# EAGLE design skware-one-rev-arm-25-mini (EAGLE 9.1.0)
CNAME: Omzlo; DESIGNER: Alain Pannetrat
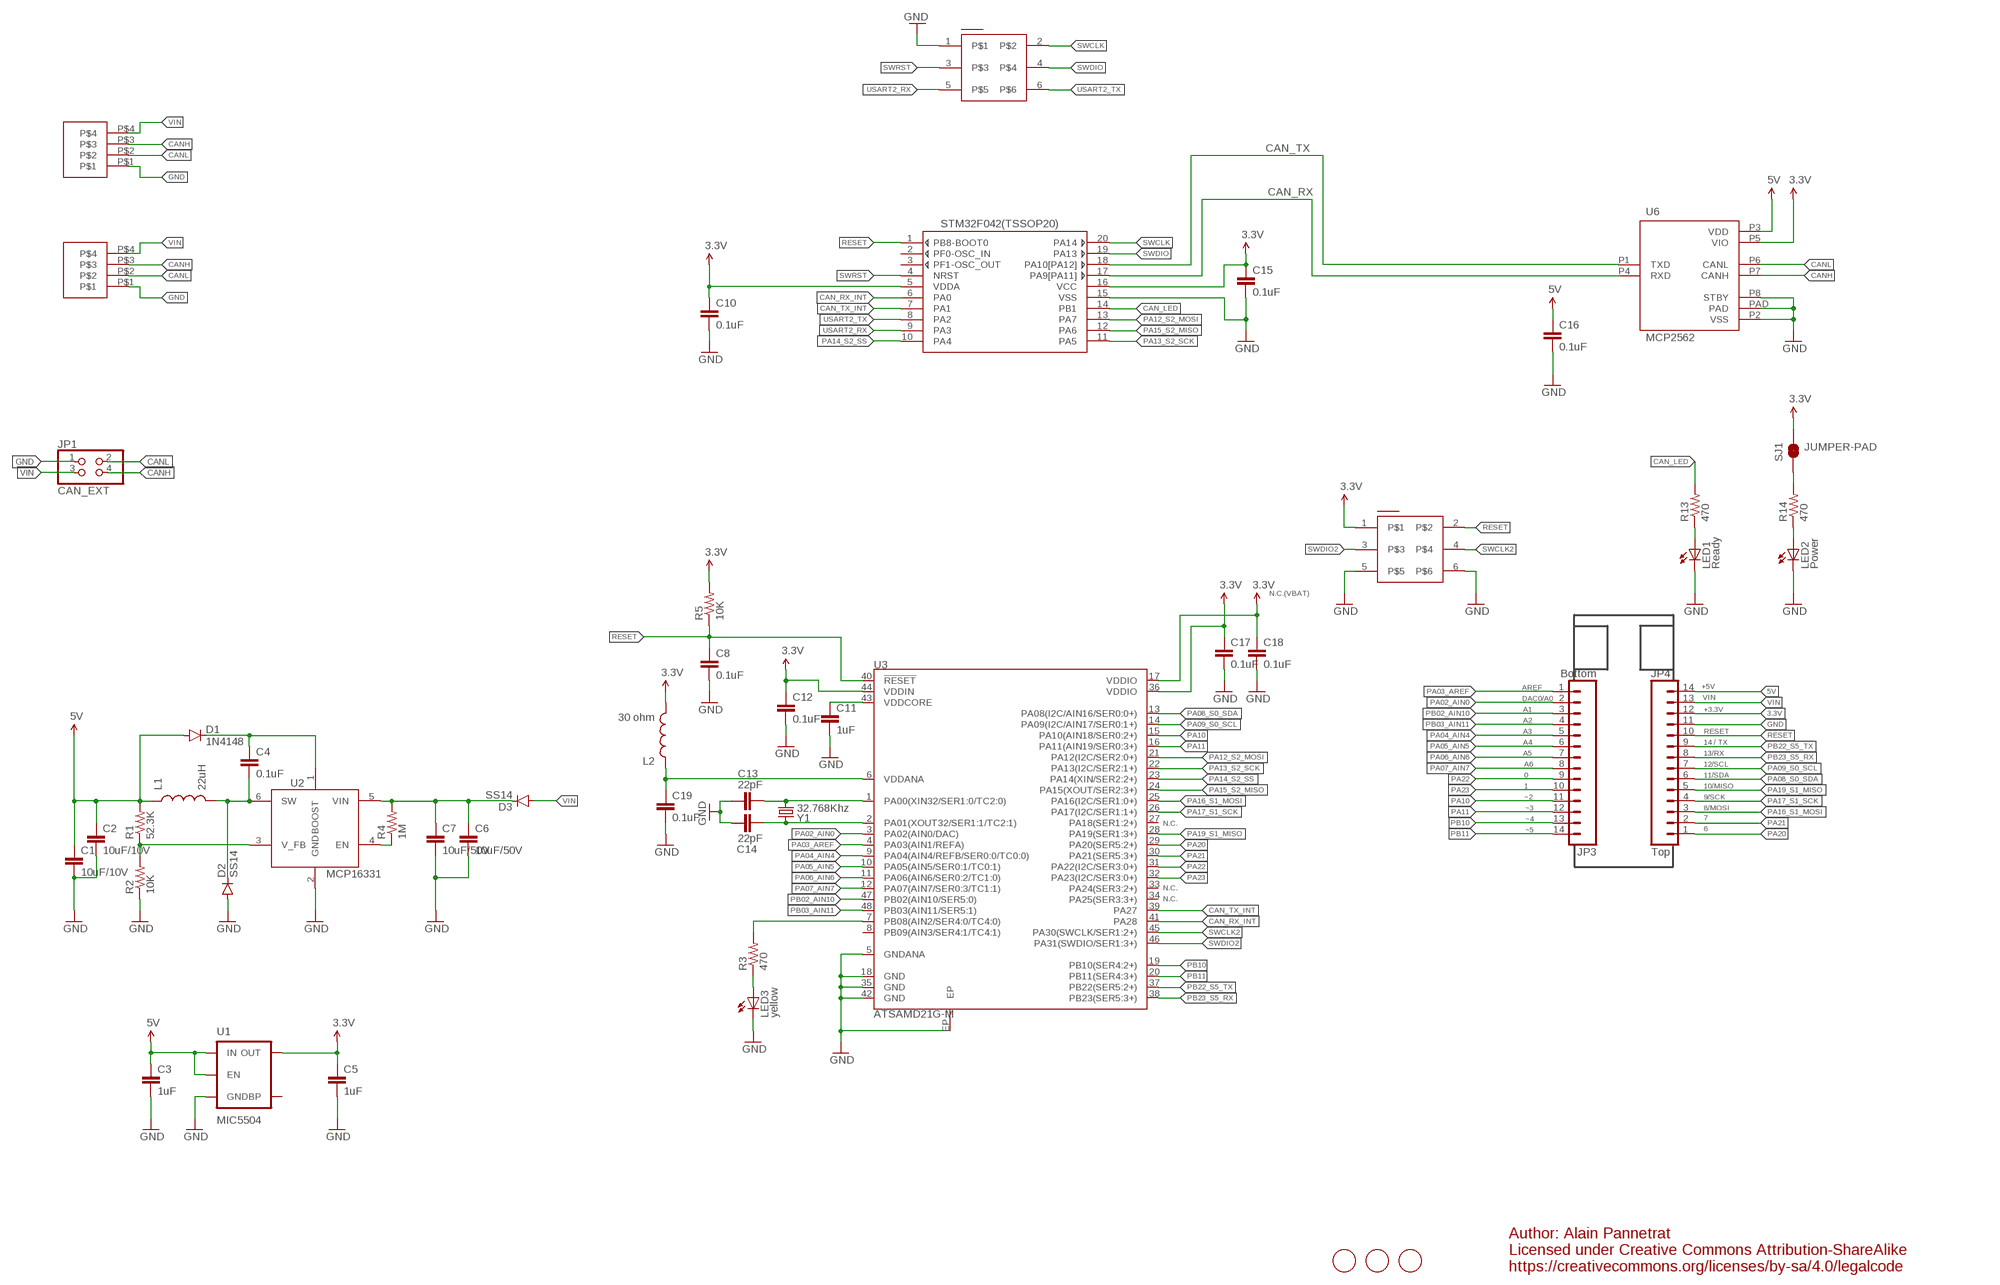
[diagram p0: schematic, sheet 1]

## Parts
C1  10uF/10V  CAP0805  [0805]
C2  10uF/10V  CAP0805  [0805]
C3  1uF  CAP0805  [0805]
C4  0.1uF  CAP0603-CAP  [0603-CAP]
C5  1uF  CAP0805  [0805]
C6  10uF/50V  CAP1206  [1206]
C7  10uF/50V  CAP1206  [1206]
C8  0.1uF  CAP0603-CAP  [0603-CAP]
C10  0.1uF  CAP0603-CAP  [0603-CAP]
C11  1uF  CAP0805  [0805]
C12  0.1uF  CAP0603-CAP  [0603-CAP]
C13  22pF  CAP0805  [0805]
C14  22pF  CAP0805  [0805]
C15  0.1uF  CAP0603-CAP  [0603-CAP]
C16  0.1uF  CAP0603-CAP  [0603-CAP]
C17  0.1uF  CAP0603-CAP  [0603-CAP]
C18  0.1uF  CAP0603-CAP  [0603-CAP]
C19  0.1uF  CAP0603-CAP  [0603-CAP]
D1  1N4148  DIODEBAS16  [SOD-323]
D2  SS14  DIODESMA-ALT  [SMA-DIODE_ALT]
D3  SS14  DIODESMA-ALT  [SMA-DIODE_ALT]
JP1  CAN_EXT  PINHD-2X2  [2X02]
JP3  Bottom  M14  [1X14]
JP4  Top  M14  [1X14]
L1  22uH  INDUCTORBOURNS_SRN6045  [SRN6045]
L2  30 ohm  INDUCTOR30OHM,1.8A  [0603]
LED1  Ready  LEDSML0805  [SML0805]
LED2  Power  LEDSML0805  [SML0805]
LED3  yellow  LEDSML0805  [SML0805]
R1  52.3K  RESISTOR0805-RES  [0805]
R2  10K  RESISTOR0805-RES  [0805]
R3  470  RESISTOR0603-RES  [0603-RES]
R4  1M  RESISTOR0805-RES  [0805]
R5  10K  RESISTOR0805-RES  [0805]
R13  470  RESISTOR0603-RES  [0603-RES]
R14  470  RESISTOR0603-RES  [0603-RES]
SJ1  JUMPER-PAD  JUMPER-PAD-2-NC_BY_TRACE  [PAD-JUMPER-2-NC_BY_TRACE_YES_SILK]
U1  MIC5504  V_REG_LDOSMD  [SOT23-5]
U2  MCP16331  [SOT23-6]
U3  ATSAMD21G-M  [QFN-48]
U4  STM32F042(TSSOP20)  [TSSOP20]
U6  MCP2562  [DFN3X3]
U$1  M04-PLUG-3.5  [M04-PLUG-3.5]
U$3  M04-PLUG-3.5  [M04-PLUG-3.5]
U$4  3X2-SMT-PROG  [2X3-SMT-HEAD]
U$5  3X2-SMT-PROG  [2X3-SMT-HEAD]
U$6  FIDUCIAL  [FIDUCIAL_1MM]
U$7  FIDUCIAL  [FIDUCIAL_1MM]
U$8  FIDUCIAL  [FIDUCIAL_1MM]
Y1  32.768Khz  CRYSTAL3.2X1.5MM  [CRYSTAL-SMD-3.2X1.5MM]

## Nets
3.3V: C5.1 C10.1 C12.1 C15.1 C17.1 C18.1 JP4.12 L2.2 R5.2 SJ1.2 U1.5(OUT) U3.17(VDDIO) U3.36(VDDIO) U3.44(VDDIN) U4.5(VDDA) U4.16(VCC) U6.P5(VIO) U$4.1
5V: C1.1 C2.1 C3.1 C16.1 D1.A JP4.14 L1.1 R1.2 U1.1(IN) U1.3(EN) U6.P3(VDD)
A1: R3.2 U3.7(PB08(AIN2/SER4:0/TC4:0))
CAN_LED: R13.2 U4.14(PB1)
CAN_RX: U4.17(PA9[PA11]) U6.P4(RXD)
CAN_RX_INT: U3.41(PA28) U4.6(PA0)
CAN_TX: U4.18(PA10[PA12]) U6.P1(TXD)
CAN_TX_INT: U3.39(PA27) U4.7(PA1)
CANH: JP1.4 U6.P7(CANH) U$1.P$3 U$3.P$3
CANL: JP1.2 U6.P6(CANL) U$1.P$2 U$3.P$2
GND: C1.2 C2.2 C3.2 C5.2 C6.2 C7.2 C8.2 C10.2 C11.2 C12.2 C13.1 C14.1 C15.2 C16.2 C17.2 C18.2 C19.2 D2.A JP1.1 JP4.11 LED1.C LED2.C LED3.C R2.1 U1.2(GND) U2.2(GND) U3.5(GNDANA) U3.18(GND) U3.35(GND) U3.42(GND) U3.EP U4.15(VSS) U6.P2(VSS) U6.P8(STBY) U6.PAD U$1.P$1 U$3.P$1 U$4.5 U$4.6 U$5.1
N$1: R4.1 U2.4(EN)
N$2: C11.1 U3.43(VDDCORE)
N$3: C13.2 U3.1(PA00(XIN32/SER1:0/TC2:0)) Y1.P$2
N$4: C14.2 U3.2(PA01(XOUT32/SER1:1/TC2:1)) Y1.P$1
N$5: C19.1 L2.1 U3.6(VDDANA)
N$6: R14.2 SJ1.1
N$7: LED2.A R14.1
N$8: C6.1 C7.1 D3.C R4.2 U2.5(VIN)
N$9: LED3.A R3.1
N$13: LED1.A R13.1
N$16: R1.1 R2.2 U2.3(V_FB)
N$17: C4.2 D2.C L1.2 U2.6(SW)
N$18: C4.1 D1.C U2.1(BOOST)
PA02_AIN0: JP3.2 U3.3(PA02(AIN0/DAC))
PA03_AREF: JP3.1 U3.4(PA03(AIN1/REFA))
PA04_AIN4: JP3.5 U3.9(PA04(AIN4/REFB/SER0:0/TC0:0))
PA05_AIN5: JP3.6 U3.10(PA05(AIN5/SER0:1/TC0:1))
PA06_AIN6: JP3.7 U3.11(PA06(AIN6/SER0:2/TC1:0))
PA07_AIN7: JP3.8 U3.12(PA07(AIN7/SER0:3/TC1:1))
PA08_S0_SDA: JP4.6 U3.13(PA08(I2C/AIN16/SER0:0+))
PA09_S0_SCL: JP4.7 U3.14(PA09(I2C/AIN17/SER0:1+))
PA10: JP3.11 U3.15(PA10(AIN18/SER0:2+))
PA11: JP3.12 U3.16(PA11(AIN19/SER0:3+))
PA12_S2_MOSI: U3.21(PA12(I2C/SER2:0+)) U4.13(PA7)
PA13_S2_SCK: U3.22(PA13(I2C/SER2:1+)) U4.11(PA5)
PA14_S2_SS: U3.23(PA14(XIN/SER2:2+)) U4.10(PA4)
PA15_S2_MISO: U3.24(PA15(XOUT/SER2:3+)) U4.12(PA6)
PA16_S1_MOSI: JP4.3 U3.25(PA16(I2C/SER1:0+))
PA17_S1_SCK: JP4.4 U3.26(PA17(I2C/SER1:1+))
PA19_S1_MISO: JP4.5 U3.28(PA19(SER1:3+))
PA20: JP4.1 U3.29(PA20(SER5:2+))
PA21: JP4.2 U3.30(PA21(SER5:3+))
PA22: JP3.9 U3.31(PA22(I2C/SER3:0+))
PA23: JP3.10 U3.32(PA23(I2C/SER3:0+))
PB02_AIN10: JP3.3 U3.47(PB02(AIN10/SER5:0))
PB03_AIN11: JP3.4 U3.48(PB03(AIN11/SER5:1))
PB10: JP3.13 U3.19(PB10(SER4:2+))
PB11: JP3.14 U3.20(PB11(SER4:3+))
PB22_S5_TX: JP4.9 U3.37(PB22(SER5:2+))
PB23_S5_RX: JP4.8 U3.38(PB23(SER5:3+))
RESET: C8.1 JP4.10 R5.1 U3.40(!RESET!) U4.1(PB8-BOOT0) U$4.2
SWCLK: U4.20(PA14) U$5.2
SWCLK2: U3.45(PA30(SWCLK/SER1:2+)) U$4.4
SWDIO: U4.19(PA13) U$5.4
SWDIO2: U3.46(PA31(SWDIO/SER1:3+)) U$4.3
SWRST: U4.4(NRST) U$5.3
USART2_RX: U4.9(PA3) U$5.5
USART2_TX: U4.8(PA2) U$5.6
VIN: D3.A JP1.3 JP4.13 U$1.P$4 U$3.P$4
Unconnected: U1.4(BP) U3.8(PB09(AIN3/SER4:1/TC4:1)) U3.27(PA18(SER1:2+)) U3.33(PA24(SER3:2+)) U3.34(PA25(SER3:3+)) U4.2(PF0-OSC_IN) U4.3(PF1-OSC_OUT)

## Notes on the sheet
- N.C.(VBAT)
- AREF | +5V
- DAC0/A0 | VIN
- A1 | +3.3V
- A2
- A3 | RESET
- A4 | 14 / TX
- A5 | 13/RX
- A6 | 12/SCL
- 0 | 11/SDA
- 1 | 10/MISO
- ~2 | 9/SCK
- ~3 | 8/MOSI
- ~4 | 7
- N.C.
- ~5 | 6
- N.C.
- N.C.
- Author: Alain Pannetrat
  Licensed under Creative Commons Attribution-ShareAlike
  https://creativecommons.org/licenses/by-sa/4.0/legalcode

## Library data of the parts
C1-C3 C5-C7 = SparkFun-Capacitors:CAP: Capacitor Standard 0603 ceramic capacitor, and 0.1" leaded capacitor.
C4 C8 C10-C19 = SparkFun-Passives:CAP: Capacitor Standard 0603 ceramic capacitor, and 0.1" leaded capacitor.
D1 = SparkFun-DiscreteSemi:DIODE: Diode These are standard reverse protection diodes and small signal diodes. SMA package can handle up to about 1A. SOD-323 can handle about 200mA. What the SOD-323 package when ordering, there are some mfgs out there that are 5-pin packages.; PROD_ID: DIO-09646; VALUE: 250mA/100V
D2 D3 = SparkFun-DiscreteSemi:DIODE: Diode These are standard reverse protection diodes and small signal diodes. SMA package can handle up to about 1A. SOD-323 can handle about 200mA. What the SOD-323 package when ordering, there are some mfgs out there that are 5-pin packages.
JP1 = pinhead:PINHD-2X2: PIN HEADER
JP3 JP4 = SparkFun-Connectors:M14: Header 14 Standard 14-pin 0.1" header. Use with straight break away headers (SKU : PRT-00116), right angle break away headers (PRT-00553), swiss pins (PRT-00743), machine pins (PRT-00117), and female headers (PRT-00115).
L1 = SparkFun-Passives:INDUCTOR: Inductors Basic Inductor/Choke - 0603 and 1206. Footprints are not proven and vary greatly between part numbers. INDUCTOR POWER 3.3UH 4.0A SMD 0.197" L x 0.197" W x 0.177" H (5.00mm x 5.00mm x 4.50mm); PROD_ID: NDUC-11627; VALUE: 33uH
L2 = SparkFun-Passives:INDUCTOR: Inductors Basic Inductor/Choke - 0603 and 1206. Footprints are not proven and vary greatly between part numbers. INDUCTOR POWER 3.3UH 4.0A SMD 0.197" L x 0.197" W x 0.177" H (5.00mm x 5.00mm x 4.50mm); PROD_ID: RES-07859
LED1-LED3 = led:LED: LED OSRAM: - CHIPLED LG R971, LG N971, LY N971, LG Q971, LY Q971, LO R971, LY R971 LH N974, LH R974 LS Q976, LO Q976, LY Q976 LO Q996 - Hyper CHIPLED LW Q18S LB Q993, LB Q99A, LB R99A - SideLED LS A670, LO A670, LY A670, LG A670, LP A670 LB A673, LV A673, LT A673, LW A673 LH A674 LY A675 LS A676, LA A676, LO A676, LY A676, LW A676 LS A679, LY A679, LG A679 - Hyper Micro SIDELED® LS Y876, LA Y876, LO Y876, LY Y876 LT Y87S - SmartLED LW L88C, LW L88S LB L89C, LB L89S, LG L890 LS L89K, LO L89K, LY L89K LS L896, LA L896, LO L896, LY L896 - TOPLED LS T670, LO T670, LY T670, LG T670, LP T670 LSG T670, LSP T670, LSY T670, LOP T670, LYG T670 LG T671, LOG T671, LSG T671 LB T673, LV T673, LT T673, LW T673 LH T674 LS T676, LA T676, LO T676, LY T676, LB T676, LH T676, LSB T676, LW T676 LB T67C, LV T67C, LT T67C, LS T67K, LO T67K, LY T67K, LW E67C LS E67B, LA E67B, LO E67B, LY E67B, LB E67C, LV E67C, LT E67C LW T67C LS T679, LY T679, LG T679 LS T770, LO T770, LY T770, LG T770, LP T770 LB T773, LV T773, LT T773, LW T773 LH T774 LS E675, LA E675, LY E675, LS T675 LS T776, LA T776, LO T776, LY T776, LB T776 LHGB T686 LT T68C, LB T68C - Hyper Mini TOPLED® LB M676 - Mini TOPLED Santana® LG M470 LS M47K, LO M47K, LY M47K Source: http://www.osram.convergy.de LUXEON: - LUMILED® LXK2-PW12-R00, LXK2-PW12-S00, LXK2-PW14-U00, LXK2-PW14-V00 LXK2-PM12-R00, LXK2-PM12-S00, LXK2-PM14-U00 LXK2-PE12-Q00, LXK2-PE12-R00, LXK2-PE12-S00, LXK2-PE14-T00, LXK2-PE14-U00 LXK2-PB12-K00, LXK2-PB12-L00, LXK2-PB12-M00, LXK2-PB14-N00, LXK2-PB14-P00, LXK2-PB14-Q00 LXK2-PR12-L00, LXK2-PR12-M00, LXK2-PR14-Q00, LXK2-PR14-R00 LXK2-PD12-Q00, LXK2-PD12-R00, LXK2-PD12-S00 LXK2-PH12-R00, LXK2-PH12-S00 LXK2-PL12-P00, LXK2-PL12-Q00, LXK2-PL12-R00 Source: www.luxeon.com KINGBRIGHT: KA-3528ASYC Source: www.kingbright.com
R1-R5 R13 R14 = SparkFun-Resistors:RESISTOR: Resistor Basic schematic elements and footprints for 0603, 1206, and PTH resistors.
SJ1 = SparkFun-Passives:JUMPER-PAD-2-NC_BY_TRACE
U1 = SparkFun-PowerIC:V_REG_LDO: Voltage Regulator LDO Standard 150mA LDO voltage regulator in SOT-23 layout. Micrel part MIC5205. BP (by-pass) pin is used to lower output noise with 470pF cap.
U2 = AlainElements:MCP16331: High-Voltage Input Integrated Switch Step-Down Regulator, 500 mA The MCP16331 is a highly integrated, high-efficiency, fixed frequency, step-down DC-DC converter in a popular 6-pin SOT-23 or 8-pin TDFN 2x3 package that operates from input voltage sources up to 50V. http://www.mouser.com/ds/2/268/20005308B-708938.pdf
U3 = SparkFun-DigitalIC:ATSAMD21G: Atmel SAMD21G SMART ARM-Based Microcontroller The Atmel ® | SMART ™ SAM D21 is a series of low-power microcontrollers using the 32-bit ARM ® Cortex ® -M0+ processor, and ranging from 32- to 64-pins with up to 256KB Flash and 32KB of SRAM. The SAM D21 devices operate at a maximum frequency of 48MHz and reach 2.46 CoreMark/MHz. They are designed for simple and intuitive migration with identical peripheral modules, hex compatible code, identical linear address map and pin compatible migration paths between all devices in the product series. All devices include intelligent and flexible peripherals, Atmel Event System for inter-peripheral signaling, and support for capacitive touch button, slider and wheel user interfaces.; PROD_ID: IC-13064
U4 = AlainElements:STM32F042(TSSOP20)
U6 = can:MCP2562
U$1 U$3 = AlainConnector:M04-PLUG-3.5
U$4 U$5 = AlainConnector:3X2-SMT-PROG
U$6-U$8 = adafruit:FIDUCIAL: For use by pick and place machines to calibrate the vision/machine, 1mm By microbuilder.eu
Y1 = SparkFun-FreqCtrl:CRYSTAL: Various standard crystals. Proven footprints.

## Board
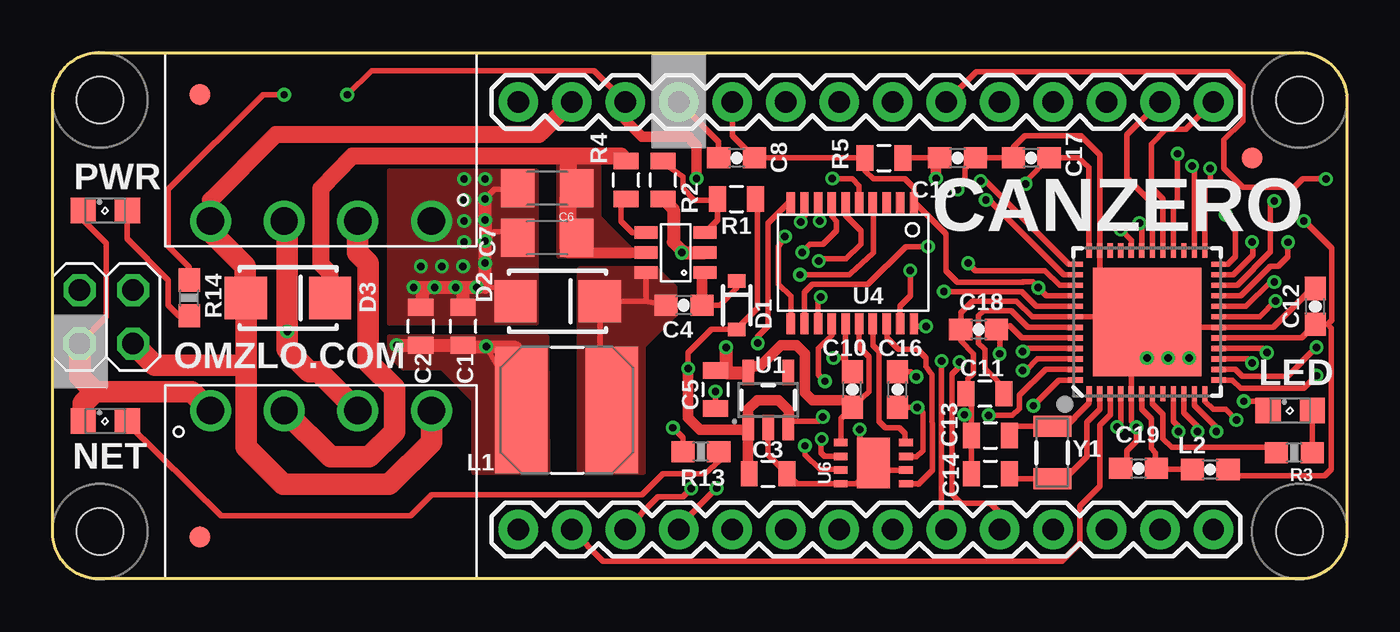
[diagram p1: board, top side]
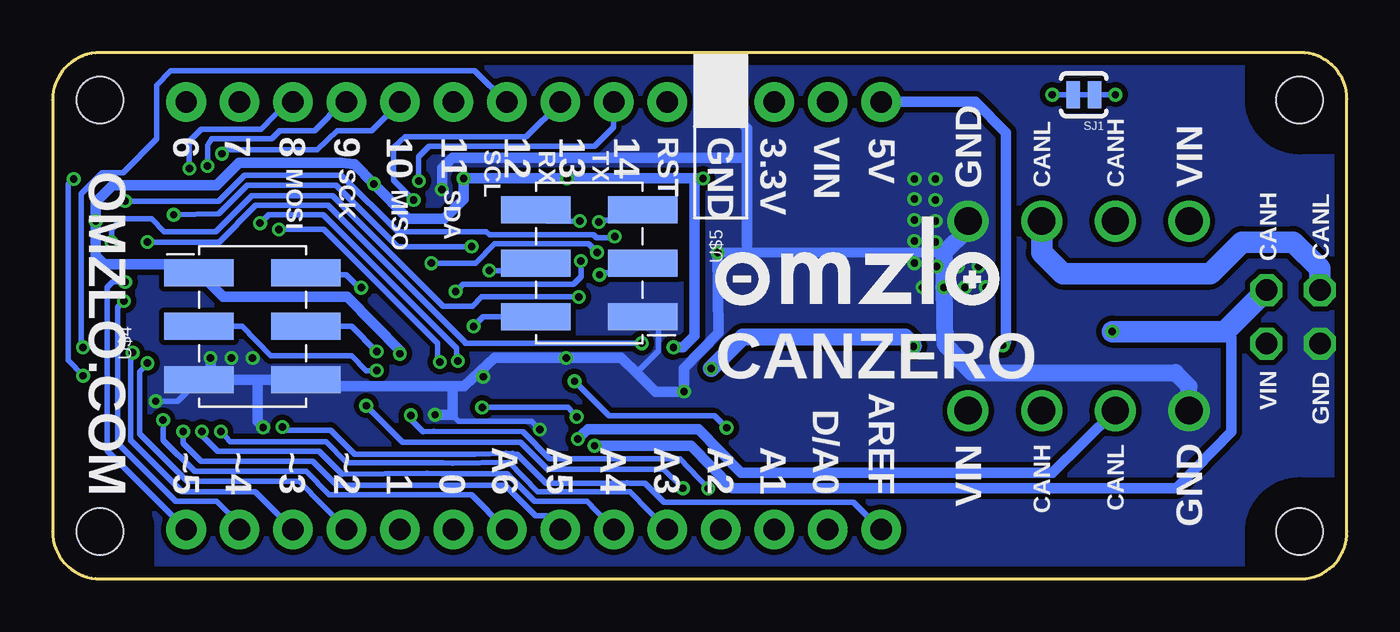
[diagram p2: board, bottom side, seen from below]

Size 61.5 x 25 mm. Coordinates in mm from the lower left corner, seen from the top.
Outline: 2.2,25 59.25,25 arc-90 61.5,22.75 61.5,2.25 arc-90 59.25,0 2.15,0 arc-90 0,2.25 0,22.8 arc-90 2.2,25
Copper layers (1*16): Top 0.035mm / dielectric 1.6mm / Bottom 0.035mm
Design rules "Elecrow_2-layer_PCB_eagle_rule *": minimum track width 6mil, minimum drill 12mil, track to track 6mil, track to pad 6mil, pad to pad 6mil, via to via 8mil, smd to smd 0mil, copper to edge 20mil, drill to drill 10mil, minimum pad ring 6mil, minimum via ring 6mil, stop-mask expansion 0mil, vias tented up to drill 100mil, thermal gap 10mil
Holes 2.2 mm at 2.25,2.25 2.25,22.75 59.25,22.75 59.25,2.25
tRestrict: area 0,20.5 to 4.5,25; area 0,0 to 4.5,4.5; area 57,20.5 to 61.5,25; area 57,0 to 61.5,4.5
bRestrict: area 0,20.5 to 4.5,25; area 0,0 to 4.5,4.5; area 57,20.5 to 61.5,25; area 57,0 to 61.5,4.5

### Footprints (pad centres in the part's own frame; a part is rotated, then mirrored left to right if it is on the bottom)
0805 = smd 0.8 x 1.2: 1 -0.9,0; 2 0.9,0
0603-CAP = smd 1.1 x 1: 1 -0.85,0; 2 0.85,0
1206 = smd 1.6 x 1.8: 1 -1.4,0; 2 1.4,0
SOD-323 = smd 0.63 x 0.83: A 1.15,0; C -1.15,0
SMA-DIODE_ALT = smd 2 x 2: A -2,0; C 2,0
2X02 = drill 1.016 octagon: 1 -1.27,-1.27; 2 -1.27,1.27; 3 1.27,-1.27; 4 1.27,1.27
1X14 = drill 1.016 pad 1.88: 1 0,0; 2 2.54,0; 3 5.08,0; 4 7.62,0; 5 10.16,0; 6 12.7,0; 7 15.24,0; 8 17.78,0; 9 20.32,0; 10 22.86,0; 11 25.4,0; 12 27.94,0; 13 30.48,0; 14 33.02,0
SRN6045 = smd 2.5 x 6: 1 -2.175,-0.175; 2 2.125,-0.175
0603 = smd 1.1 x 1: 1 -0.85,0; 2 0.85,0
SML0805 = smd 1.2 x 1.2: A 1.05,0; C -1.05,0
0603-RES = smd 1.1 x 1: 1 -0.85,0; 2 0.85,0
PAD-JUMPER-2-NC_BY_TRACE_YES_SILK = smd 0.635 x 1.27: 1 -0.508,0; 2 0.508,0
SOT23-5 = smd 0.55 x 1.2: 1 -0.95,-1.3; 2 0,-1.3; 3 0.95,-1.3; 4 0.95,1.3; 5 -0.95,1.3
SOT23-6 = smd 0.6 x 1.1: 1 -0.95,-1.4; 2 0,-1.4; 3 0.95,-1.4; 4 0.95,1.4; 5 0,1.4; 6 -0.95,1.4
QFN-48 = smd 0.7 x 0.25: 1 -3.4,2.75; 2 -3.4,2.25; 3 -3.4,1.75; 4 -3.4,1.25; 5 -3.4,0.75; 6 -3.4,0.25; 7 -3.4,-0.25; 8 -3.4,-0.75; 9 -3.4,-1.25; 10 -3.4,-1.75; 11 -3.4,-2.25; 12 -3.4,-2.75; 25 3.4,-2.75; 26 3.4,-2.25; 27 3.4,-1.75; 28 3.4,-1.25; 29 3.4,-0.75; 30 3.4,-0.25; 31 3.4,0.25; 32 3.4,0.75; 33 3.4,1.25; 34 3.4,1.75; 35 3.4,2.25; 36 3.4,2.75 | smd 0.25 x 0.7: 13 -2.75,-3.4; 14 -2.25,-3.4; 15 -1.75,-3.4; 16 -1.25,-3.4; 17 -0.75,-3.4; 18 -0.25,-3.4; 19 0.25,-3.4; 20 0.75,-3.4; 21 1.25,-3.4; 22 1.75,-3.4; 23 2.25,-3.4; 24 2.75,-3.4; 37 2.75,3.4; 38 2.25,3.4; 39 1.75,3.4; 40 1.25,3.4; 41 0.75,3.4; 42 0.25,3.4; 43 -0.25,3.4; 44 -0.75,3.4; 45 -1.25,3.4; 46 -1.75,3.4; 47 -2.25,3.4; 48 -2.75,3.4 | smd 5.15 x 5.15: EP 0,0
TSSOP20 = smd 1 x 0.4: 1 -2.875,2.925; 2 -2.875,2.275; 3 -2.875,1.625; 4 -2.875,0.975; 5 -2.875,0.325; 6 -2.875,-0.325; 7 -2.875,-0.975; 8 -2.875,-1.625; 9 -2.875,-2.275; 10 -2.875,-2.925; 11 2.875,-2.925; 12 2.875,-2.275; 13 2.875,-1.625; 14 2.875,-0.975; 15 2.875,-0.325; 16 2.875,0.325; 17 2.875,0.975; 18 2.875,1.625; 19 2.875,2.275; 20 2.875,2.925
DFN3X3 = smd 0.35 x 0.65: P1 -0.975,-1.55; P2 -0.325,-1.55; P3 0.325,-1.55; P4 0.975,-1.55; P5 0.975,1.55; P6 0.325,1.55; P7 -0.325,1.55; P8 -0.975,1.55 | smd 2.4 x 1.55: PAD 0,0
M04-PLUG-3.5 = drill 1.3: P$1 0,0; P$2 3.5,0; P$3 7,0; P$4 10.5,0
2X3-SMT-HEAD = smd 1.27 x 3.302: 1 -2.54,-2.54; 2 -2.54,2.54; 3 0,-2.54; 4 0,2.54; 5 2.54,-2.54; 6 2.54,2.54
FIDUCIAL_1MM = smd 1 x 1: 1 0,0
CRYSTAL-SMD-3.2X1.5MM = smd 1 x 1.8: P$1 -1.25,0; P$2 1.25,0

### Placement (x,y rotation side)
C1  19.5,12 90 top
C2  17.5,12 90 top
C3  34,5 0 top
C4  30,13 180 top
C5  31.5,9 270 top
C6  23.5,18.55 180 top
C7  23.5,16.2 180 top
C8  32.5,20 180 top
C10  38,9 90 top
C11  44.3,8.8 180 top
C12  60,12.95 90 top
C13  44.56,6.82 0 top
C14  44.56,5 0 top
C15  43,20 0 top
C16  40.15,9 90 top
C17  46.5,20 180 top
C18  44,11.85 180 top
C19  51.6,5.25 180 top
D1  32.5,13 270 top
D2  24,13.2 0 top
D3  11.18,13.35 0 top
JP1  2.55,12.45 0 top
JP3  22.13,2.34 0 top
JP4  55.15,22.66 180 top
L1  24.45,8.2 0 top
L2  55,5.2 0 top
LED1  2.5,7.5 0 top
LED2  2.5,17.5 0 top
LED3  58.8,8 0 top
R1  32.5,18.05 0 top
R2  29,18.95 90 top
R3  59,6 180 top
R4  27.25,18.95 90 top
R5  39.5,20 0 top
R13  30.8,6.05 180 top
R14  6.5,13.35 90 top
SJ1  12.5,23 180 bottom
U1  34,8.5 0 top
U2  29.6,15.5 90 top
U3  52,12.2 90 top
U4  38,15 270 top
U6  39,5.5 90 top
U$1  7.5,8 0 top
U$2  [OMZLO-0.5]  30,13 0 bottom
U$3  18,17 180 top
U$4  52,12 270 bottom
U$5  36,15 90 bottom
U$6  7,2 0 top
U$7  7,23 0 top
U$8  57,20 0 top
Y1  47.5,6 90 top

### Tracks (layer width: path | path; a pad name or v marks a point on that pad's centre or on a via)
3.3V  (via drill 0.35)
  Top 0.254: JP4.12 25.73,24.15 15.15,24.15 v14,23 | U3.36 49.25,19.55 48.75,20 C17.1 46.24,18.89 v46.24,18.77 | 32.9,9.95 U1.5 | C15.1 R5.2 | U3.44 46.05,11.45 45.48,12.02 44.8,11.85 C18.1 45.15,11.85 45.1,11.8 45.05,11.8 45,11.75 v45,10.7 | 38.35,12.1 U4.16 38.33,11.03 38.8,10.55 38.8,8.9 38.18,8.31 38.01,8.15 C10.1 | 37.5,6.53 U6.P5 37.45,7.6 C10.1 | 35.75,8.98 35.74,8.94 | 33.2,10.1 U1.5 | 60.6,12.1 60.79,12.29 60.79,15.71 59.5,17 v59.45,17 | U3.17 59.35,11.45 C12.1 60.6,12.1 | 32.95,9.9 U1.5 | U4.5 38.33,18.68 38,19 37.08,19 v37.05,19.02 | C10.1 37.65,8.5 | L2.2 56.35,4.95 56.4,4.9 60.45,4.9 60.75,5.2 60.75,11.9 60.6,12.1
  Top 0.508: JP4.12 27.21,21.79 28,21 30.2,21 30.58,20.57 30.59,18.97 v30.6,19.02 | C15.1 41.98,19.82 v41.98,19.02 | 37.65,8.5 36.1,8.5 35.75,8.85 35.75,8.98 | 35.74,8.94 35.74,10.71 35.35,11.1 34.6,11.1 33.6,10.1 33.2,10.1
  Top 0.61: 32,9.8 U1.5 | 32,9.8 31.6,9.8 C5.1 | v32,11 32,9.8
  Bottom 0.254: 44.98,10.67 v45,10.7 | SJ1.2 v14,23
  Bottom 0.508: v32,11 31.55,11 31,11.55 31,18.92 v30.6,19.02 v37.05,19.02 v41.98,19.02 41.98,18.02 42.9,17.1 44.6,17.1 v46.24,18.77 47.15,19.7 47.78,19.77 52.63,19.77 53.7,18.7 58.65,18.7 59.45,17.9 v59.45,17 59.45,15.35 59.05,14.95 54.95,14.95 U$4.1 53.4,13.4 47.5,13.4 44.98,10.83 44.98,10.67
5V  (via drill 0.35)
  Top 0.254: 22.32,8 22.32,8.68 | 22.32,8 L1.1 22.27,6.22 | 20,11 19.1,11 C1.1 | 33.05,5.05 C3.1 | 34.95,7.5 U1.3 | R1.2 33.3,17.85 33.5,18 33.5,12.85 D1.A 31.3,11.85 30.2,10.75 v30.2,10 | 35,7.5 36.4,7.5 v36.6,7.7 | U6.P3 40.58,5.8 41.05,5.8 41.35,6.1 41.35,7.9 41.09,8.16 | 33.05,6 33.2,6.15 | v20.6,11.05 22.32,8 | v41.09,8.14 41.09,8.16 | 41.09,8.16 41.08,8.15 C16.1
  Top 0.508: 33.05,6.7 33.05,6 33.05,5.05 | 33.05,6.7 U1.1 33.05,8.05 33.5,8.5 34.5,8.5 35,8 35,7.5 34.95,7.5 | 33.05,6.7 32.96,7.09 30.76,7.09 30.2,7.65 v30.2,10
  Top 0.61: 22.32,8.68 22,11 20,11 | C1.1 C2.1 v16.35,11.1
  Bottom 0.254: v36.6,7.7 37.01,8.14 v41.09,8.14
  Bottom 0.508: JP4.14 17.66,22.66 16.2,21.2 16.2,11.25 v16.35,11.1
  Bottom 0.813: v30.2,10 28.7,11.5 21,11.5 20.6,11.1 v20.6,11.05
  pour Top (no thermals): 16,11.5 23.5,11.5 23.55,5.05 20,5.05 20,8.5 18.5,10 16.65,10 16,10.65
A1
  Top 0.254: U3.7 52.25,8.32 52.74,7.83 52.74,6.65 53.19,6.25 57.9,6.25 R3.2
CAN_LED  (via drill 0.35)
  Top 0.254: U4.14 37.02,11.57 36.4,10.95 36.4,9.7 v36.7,9.4 v36.7,9.39 | R13.2 29.95,6.7 v29.47,7.18
  Bottom 0.254: v36.7,9.39 36.66,9.35 35.05,7.75 30.04,7.75 v29.47,7.18
CAN_RX
  Top 0.254: U6.P4 40.5,6.53 40.49,6.92 40.24,7.18 39.57,7.18 39.26,7.49 39.26,10.82 38.98,11.1 U4.17
CAN_RX_INT  (via drill 0.35)
  Top 0.254: U3.41 46.75,12.95 46.05,13.65 v42.35,13.65 | U4.6 37.67,17.27 38.4,16.55 38.4,15.9 37.7,15.2 36.5,15.2 v36.4,15.1
  Bottom 0.254: v36.4,15.1 36.4,14.35 36.75,14 42,14 v42.35,13.65
CAN_TX
  Top 0.254: U4.18 39.65,11.45 40.2,10.9 41.1,10.9 41.5,10.5 41.5,10.1 41.79,9.71 41.8,5.16 41.15,4.5 41.17,4.53 U6.P1
CAN_TX_INT  (via drill 0.35)
  Top 0.254: U3.39 47.85,13.95 47.15,14.65 43.85,14.65 v43.5,15 | U4.7 37.02,17.23 37.25,17 37.25,16.55 36.6,15.9 35.99,15.9 v35.63,15.52
  Bottom 0.254: v35.63,15.52 36.03,15.91 40.49,15.91 41.41,15 v43.5,15
CANH  (via drill 0.35)
  Top 0.254: U6.P7 37.42,5.2 36.45,5.2 35.75,5.9 v35.75,6.33
  Top 1.016: U$3.P$3 11.15,16.85 v11.15,11.75 11.15,10.9 12.2,9.85 12.65,9.85 U$1.P$3
  Bottom 0.508: v35.75,6.33 31.18,6.33 29.2,4.3 8.1,4.3 5.5,7 5.5,11.46 5.79,11.75
  Bottom 1.016: v11.15,11.75 5.79,11.75 JP1.4
CANL  (via drill 0.35)
  Top 0.254: U6.P6 36.67,5.83 36.5,6 36.5,6.7 v36.55,6.65
  Top 1.016: U$3.P$2 14.5,15.5 15,15 15,10.3 16.25,9.05 16.25,7 15.05,5.8 13.2,5.8 U$1.P$2
  Bottom 0.508: v36.55,6.65 36.05,7.1 30.8,7.1 28.8,5.05 14,5.05 U$1.P$2
  Bottom 1.016: U$3.P$2 14.5,15.5 13.5,14.5 6.5,14.5 5,16 2.55,16 1.3,14.75 JP1.2
GND  (via drill 0.35)
  Top 0.254: C1.2 19.1,13 19.5,13 | 38.83,5.17 U6.P2 | 38.95,5.41 38.83,5.17 | 38.95,5.41 U6.PAD | 38.83,5.17 38.17,4.53 U6.P8 35.38,4.53 C3.2 | C3.2 34.9,5.1 | C14.1 C13.1 43.66,8 | 43.66,8 43.66,8.81 43.51,8.8 | C11.2 43.51,8.8 | v43,18.5 43.34,18.84 43.34,19.5 43.7,19.86 C15.2 C17.2 45.65,20.5 46.2,21.05 48.85,21.05 49.75,20.15 U3.35 49.75,13.7 51,12.45 | C16.2 40.79,9.85 v41.04,9.6 | 37.9,9.95 C10.2 37.67,10.18 37.67,10.5 | 31.4,8 C5.2 | C3.2 34,5.9 U1.2 | C5.2 31.6,8.1 | C8.2 31.65,20.77 JP4.11 | v38.35,7.1 38.35,6.45 38.7,6.1 38.7,5.65 38.95,5.41 | C5.2 v31.5,8.9 | 29.9,15.6 v29.9,15.5 | C7.2 22,16.5 21,16.5 20.6,16.1 20.6,15.95 v20.55,17.05 | D2.A 21.95,13.8 20.55,13.85 | 43.66,8 43.46,7.8 v43.33,7.8 | 51.9,12.1 U3.EP 51.75,12.45 51,12.45 | 51.9,12.1 51.25,11.45 U3.5 51.25,7.49 v51.49,7.2 51.49,6.54 51.05,6.1 51.05,5.3 C19.2 | 51,12.45 U3.42 46.55,12.45 45.8,13.2 43.7,13.2 43.15,12.65 C18.2 43.15,11.31 43.76,10.7 43.76,9.76 43.5,9.5 43.5,8.81 43.51,8.8 | 52.05,11.95 U3.18 58,11.95 59.85,13.8 C12.2 | 52.05,11.95 51.9,12.1 | v54,10.5 53.5,10.5 52.05,11.95 | U4.15 37.67,10.5 | 37.67,10.5 v37.1,10.5 | v20.55,18.05 21,18.5 22,18.5 21.9,18.4 C6.2 | LED3.C 57.51,8.44 v56.6,8.44 | JP1.1 2.55,12.45 2.55,15.95 1.45,17.05 LED2.C
  Top 0.305: 1.75,17.3 LED2.C
  Top 0.61: v29.9,15.5 U2.2 | 19.5,13.85 19.5,13 C1.2 | 17.6,13.85 v18.15,13.85 v19.15,13.85 19.5,13.85 | v17.15,13.85 17.6,13.85 | 17.6,13.85 C2.2 | 19.5,13.85 v20.15,13.85 20.55,13.85 v20.55,16.05 v20.55,17.05 v20.55,18.05 | R2.1 29.5,17.55 29.5,16 29.9,15.6
  Top 1.016: U$1.P$1 6.6,8.9 2,8.9 | JP1.1 1.28,9.62 2,8.9 | LED1.C 1.45,8.35 2,8.9
  Bottom 0.254: 33.42,12.5 U$5.1 32.7,12.15 32.7,10.85 33.75,9.8 | v41.04,9.6 41.47,9.6 41.53,9.54 | 42.5,7.8 42.2,7.5 38.75,7.5 v38.35,7.1 | 54,9.5 54.08,9.5 54.54,9.96 U$4.5 55.56,8.44 v56.6,8.44
  Bottom 0.508: 28.5,15.51 19.15,15.5 | 28.5,15.51 v29.9,15.5 29.85,11.7 31.5,10 v31.5,8.9 32.85,8.9 33.75,9.8 34.5,10.5 v37.1,10.5 40.5,10.5 41.53,9.54 41.95,9.15 42.5,9.15 | v43,18.5 43,19.5 42.5,20 28.5,20 | 42.5,9.15 42.5,7.8 v43.33,7.8 | JP4.11 28.5,21.4 28.5,20 | 28.5,20 28.5,15.51 | 42.5,9.15 49,9.15 49.31,9.46 U$4.6 51.75,9.46 | 51.75,9.46 U$4.5 | v51.49,7.2 51.75,7.49 51.75,9.46 | 54,9.5 v54,10.5
  Bottom 0.813: U$3.P$1 18,16.6 19.15,15.5 v19.15,13.85 19.1,11.15 17.8,9.8 8.15,9.8 7.5,9.15 U$1.P$1
  other vias: 20.55,15 20.55,19 19.5,14.85 18.5,14.85 17.5,14.85 19.55,19 19.55,18 19.55,17 19.55,16 53,10.5 52,10.5
  pour Top (no thermals): 16,12.15 23,12.15 23,19.4 16,19.4
  pour Bottom (isolate 0.254, no thermals): 61.5,25.5 61.5,0 0,0 0,25.5
N$1
  Top 0.254: U2.4 27.55,16.45 27,17 27,17.8 R4.1
N$2
  Top 0.254: U3.43 46.35,11.95 45.55,12.75 44.25,12.75 44,12.5 44,11.2 44.3,10.9 44.3,10 45.45,8.85 C11.1
N$3
  Top 0.254: U3.1 49.25,8.35 47.9,7 46.75,7 Y1.P$2 45.49,7.25 C13.2
N$4
  Top 0.254: U3.2 49.75,8.05 49.15,7.45 49.15,5.8 48.1,4.75 Y1.P$1 45.71,4.75 C14.2
N$5
  Top 0.254: U3.6 51.75,8.05 52.2,7.6 52.2,6.2 52.4,6 52.4,5.5 C19.1 52.85,5.2 L2.1
N$6  (via drill 0.35)
  Top 0.254: v11,23 10,23 5.5,18.5 5.5,15.8 6.5,14.8 R14.2
  Bottom 0.254: SJ1.1 v11,23
N$7
  Top 0.254: LED2.A 3.55,16.15 5.5,14.2 5.5,13 6,12.5 6.15,12.65 R14.1
N$8
  Top 0.254: 28.15,15.5 U2.5 | 13.68,12.68 D3.C | C6.1 24.65,18.2 24.6,18.25 | 27,20.1 R4.2 | 24.5,18.15 24.6,18.25 | 24.5,15.65 24.5,15.5 24.9,15.55 C7.1 | 24.5,18.35 24.6,18.25
  Top 0.508: 24.5,15.5 U2.5
  Top 0.813: D3.C 13.18,14.52 12.75,14.95 12.75,18.55 14.25,20.1 24.5,20.1 | 24.5,20.1 27,20.1 | 24.5,15.65 24.5,18.15 | 24.5,20.1 24.5,18.35
  pour Top (no thermals): 24,20 24,15.3 27.5,15.3 27.5,15.7 26,17.2 26,20
N$9
  Top 0.254: R3.1 LED3.A
N$13
  Top 0.254: R13.1 31.7,5.65 31,5 29,5 28,4 18,4 17,3 8,3 3.55,7.4 LED1.A
N$16
  Top 0.254: R2.2 28.9,19.85 29.95,19.1 29.95,18.55 30.5,18 31.55,18 R1.1 | 31.3,18.05 R1.1 | R1.1 31.6,17.05 U2.3
N$17
  Top 0.254: 29,13 C4.2 28.2,13.2 | 28.3,14.45 U2.6 28.2,13.2 | 28.2,13.2 D2.C 26,9.6 L1.2
  pour Top (no thermals): 25.05,14.8 28.7,14.8 29.6,13.9 29.6,12.5 28.1,11 28.1,5 25,5 25,14.75
N$18
  Top 0.152: C4.1 31.35,13
  Top 0.254: U2.1 30.85,14.35 | 31.35,13 31.7,13 32.5,13.8 D1.C
  Top 0.508: C4.1 30.85,14.35
PA02_AIN0
  Top 0.254: U3.3 50.25,7.8 49.75,7.3 49.75,4.4 48.8,3.45 48.8,1.7 47.95,0.85 26.16,0.85 JP3.2
PA03_AREF  (via drill 0.35)
  Top 0.254: U3.4 50.75,7.4 v50.58,7.22
  Bottom 0.254: v50.58,7.22 50.43,7.07 48.3,7.07 47.16,5.93 41.43,5.93 39.96,5.96 39.8,5.96 39.64,5.96 39.63,5.95 39.62,5.95 39.6,5.93 39.43,5.93 38.06,4.56 34.22,4.56 34.05,4.56 33.36,4.56 32.45,3.65 23.45,3.65 JP3.1
PA04_AIN4  (via drill 0.35)
  Top 0.254: U3.9 53.25,7.5 53.5,7.25 v53.5,7
  Bottom 0.254: JP3.5 34.05,4.15 38.45,4.15 39.8,5.55 42.5,5.5 42.97,5.52 47.52,5.52 48.51,6.51 53.06,6.51 v53.5,7
PA05_AIN5  (via drill 0.35)
  Top 0.254: U3.10 53.75,7.9 54.4,7.25 v54.4,7
  Bottom 0.254: JP3.6 36.09,3.7 38.6,3.7 39.9,5 43,5 43.71,5.01 47.74,4.96 48.83,6.06 53.65,6.06 54.39,6.8 v54.4,7
PA06_AIN6  (via drill 0.35)
  Top 0.254: v55.29,7 55.29,7.2 54.9,7.6 54.25,8.25 U3.11
  Bottom 0.254: JP3.7 38.03,3 38.55,3 40,4.45 43.25,4.45 44.16,4.46 48.01,4.46 49.15,5.6 54.08,5.6 54.43,5.59 55.3,6.45 55.3,6.79 v55.29,7
PA07_AIN7  (via drill 0.35)
  Top 0.254: U3.12 54.75,8.45 55.15,8.05 55.75,8.05 v56.25,7.55
  Bottom 0.254: JP3.8 40.02,2.42 41.6,4 48.35,4 49.46,5.11 54.76,5.11 56.25,6.6 v56.25,7.55
PA08_S0_SDA  (via drill 0.35)
  Top 0.254: U3.13 56.05,9.45 56.45,9.05 59.45,9.05 v60.05,9.65 | JP4.6 43.9,24.1 55.9,24.1 56.55,23.45 56.55,21.75 55.65,20.85 55.65,19.5 56.55,18.6 59,18.6 59.4,19 v60.5,19
  Bottom 0.254: v60.05,9.65 60.75,10.4 60.75,18.75 v60.5,19
PA09_S0_SCL  (via drill 0.35)
  Top 0.254: v60.06,11 58.68,9.62 56.52,9.62 56.2,9.95 U3.14
  Bottom 0.254: JP4.7 39.96,22.66 41.45,24.15 55.9,24.15 56.55,23.45 56.55,20.9 58.15,19.3 59.15,19.3 60.15,18.3 60.15,11.34 v60.06,11
PA10  (via drill 0.35)
  Top 0.254: U3.15 56,10.45 | 56,10.45 56.24,10.45 | 56,10.45 56.79,10.45 v56.99,10.25
  Bottom 0.254: JP3.11 49.8,4.65 55.1,4.65 57.35,6.9 57.35,9.85 v56.99,10.26 v56.99,10.25
PA11  (via drill 0.35)
  Top 0.254: U3.16 57.5,10.95 v57.7,10.75
  Bottom 0.254: JP3.12 51.88,4.15 55.35,4.15 57.8,6.6 57.8,10.45 v57.7,10.75
PA12_S2_MOSI  (via drill 0.35)
  Top 0.254: 36.36,12.39 U4.13 36.38,13.27 v36.5,13.39 | U3.21 56.45,13.45 57.85,14.85 58.25,14.85 58.7,15.3 v58.7,15.99
  Bottom 0.254: v36.5,13.39 41.11,13.39 41.55,12.95 42.95,12.95 48.2,18.2 52.05,18.2 53.75,16.5 56.2,16.5 56.8,17.1 58.2,17.1 58.7,16.6 v58.7,15.99
PA13_S2_SCK  (via drill 0.35)
  Top 0.254: U3.22 56.3,13.95 57.85,15.55 57.85,17.75 v58.05,17.95 | U4.11 35.08,13.43 34.5,14 34.5,15.8 34.54,15.84 v34.79,16.27
  Bottom 0.254: v58.05,17.95 53.6,17.95 52.37,19.18 47.78,19.18 45.09,16.49 40.89,16.49 40.75,16.35 35.81,16.35 35.66,16.2 34.86,16.2 v34.79,16.27
PA14_S2_SS  (via drill 0.35)
  Top 0.254: U3.23 56.1,14.45 57.02,15.38 57.02,15.83 v57,16 | U4.10 34.98,17.88 34,16.9 34,12 33.5,11.5 v33.5,11.2
  Bottom 0.254: v33.5,11.2 41.89,11.2 41.89,11.24 48.4,17.75 51.84,17.75 53.59,16 v57,16
PA15_S2_MISO  (via drill 0.35)
  Top 0.254: U3.24 55.85,14.95 56.2,15.3 56.2,16.85 v55.75,17.3 | U4.12 35.73,13.62 36.1,14 38.75,14 40.54,15.79 v41.59,15.79
  Bottom 0.254: v41.59,15.79 45.11,15.79 48.02,18.7 52.25,18.7 53.61,17.34 v55.75,17.3
PA16_S1_MOSI  (via drill 0.35)
  Top 0.254: U3.25 54.75,18.6 55,18.9 v55,19.5
  Bottom 0.254: v55,19.5 55,20.8 54.45,21.35 51.6,21.35 50.34,22.66 JP4.3
PA17_S1_SCK  (via drill 0.35)
  Top 0.254: U3.26 54.25,19.46 v54.14,19.61
  Bottom 0.254: JP4.4 47.69,22.66 49.05,21.3 50.7,21.3 51.1,20.9 53.95,20.9 54.14,20.61 v54.14,19.61
PA19_S1_MISO  (via drill 0.35)
  Top 0.254: U3.28 53.25,17.75 53.45,18 v53.45,20.2
  Bottom 0.254: v53.45,20.2 53.21,20.39 48.93,20.39 47.98,21.3 46.35,21.3 JP4.5
PA20
  Top 0.254: JP4.1 53.85,21.36 52.91,21.36 52.2,20.65 52.2,18.6 52.75,18.05 U3.29
PA21
  Top 0.254: JP4.2 52.25,22.3 51.05,21.1 51.05,19.05 52.25,17.85 U3.30
PA22  (via drill 0.35)
  Top 0.254: U3.31 51.75,16.8 v51.64,16.91 v51.64,16.9 | v42.24,10.35 42.24,2.65 42.45,2.44 JP3.9
  Bottom 0.254: v51.64,16.9 51.24,17.3 48.65,17.3 42.3,10.95 42.3,10.65 42.24,10.59 v42.24,10.35
PA23  (via drill 0.35)
  Top 0.254: U3.32 51.25,16.1 v50.75,16.6 | v43.1,10.3 43.1,10.1 42.72,9.72 42.72,4.03 43.15,3.6 44.55,3.6 45,3.15 JP3.10
  Bottom 0.254: v50.75,16.6 48.62,16.6 43.21,11.19 43.21,10.41 v43.1,10.3
PB02_AIN10  (via drill 0.35)
  Top 0.254: v30.35,4.3 29.95,3.9 28.77,3.9 JP3.3 | v44.48,7.77 45.62,7.77 45.93,8.08 45.93,8.73 47.2,9.95 U3.47
  Bottom 0.254: v44.48,7.77 44.45,7.54 43.9,7 43.41,7.01 39.15,7 37.88,5.7 31.7,5.7 v30.35,4.3
PB03_AIN11  (via drill 0.35)
  Top 0.254: v31.55,4.31 29.75,2.51 JP3.4 | U3.48 47.82,9.45 v46.6,8.23
  Bottom 0.254: v31.55,4.31 32.46,5.22 37.98,5.22 39.26,6.5 44.87,6.5 v46.6,8.23
PB10  (via drill 0.35)
  Top 0.254: U3.19 57.35,12.45 v58.11,13.21
  Bottom 0.254: v58.11,13.21 58.4,12.91 58.4,6.45 55.65,3.7 53.7,3.7 52.62,2.62 JP3.13
PB11  (via drill 0.35)
  Top 0.254: U3.20 56.69,12.95 57.85,14.1 v58.04,14.1 v58.05,14.11
  Bottom 0.254: v58.05,14.11 58.64,14.11 58.9,13.85 58.9,6.08 JP3.14
PB22_S5_TX  (via drill 0.35)
  Top 0.254: U3.37 48.3,14.95 44.35,18.9 v44.1,18.9
  Bottom 0.254: v44.1,18.9 44.1,20.05 43.6,20.55 35.75,20.55 34.85,21.45 34.85,22.64 JP4.9
PB23_S5_RX  (via drill 0.35)
  Top 0.254: U3.38 48.05,14.45 44.5,18 v44.35,18
  Bottom 0.254: v44.35,18 45.3,18.95 45.3,20.5 44.75,21 39,21 37.38,22.62 JP4.8
RESET  (via drill 0.35)
  Top 0.254: JP4.10 32.3,21.05 C8.1 R5.1 38.6,19.4 39,19 40.5,19 40.92,18.57 U4.1 41,17.85 42.45,16.4 42.45,14.65 43,14.1 46.09,14.1 46.1,14.11 46.57,14.11 v46.84,13.84 47.23,13.45 U3.40
  Bottom 0.254: v46.84,13.84 46.93,13.84 47.03,13.93 47.55,14.45 48.87,14.45 U$4.2
SWCLK  (via drill 0.35)
  Top 0.254: U4.20 41.05,12 v41.5,12
  Bottom 0.254: v41.5,12 41.04,12.46 U$5.2
SWCLK2  (via drill 0.35)
  Top 0.254: U3.45 46.26,10.95 v46.1,10.8
  Bottom 0.254: v46.1,10.8 47.3,12 U$4.4
SWDIO  (via drill 0.35)
  Top 0.254: U4.19 40.25,12.15 40.25,12.95 40.75,13.45 v40.75,14.65
  Bottom 0.254: v40.75,14.65 38.95,14.65 U$5.4
SWDIO2  (via drill 0.35)
  Top 0.254: U3.46 46.8,10.45 46.25,9.9 v46.1,9.9
  Bottom 0.254: v46.1,9.9 46.6,9.9 47.3,10.6 51.14,10.6 52.5,12 U$4.3
SWRST  (via drill 0.35)
  Top 0.254: v35.51,14.45 37.85,14.45 37.9,14.5 39,15.5 39,17.85 U4.4
  Bottom 0.254: U$5.3 33.8,14.6 33.85,14.55 35.41,14.55 v35.51,14.45
USART2_RX  (via drill 0.35)
  Top 0.254: U4.9 35.75,17.25 v35.55,16.95
  Bottom 0.254: v35.55,16.95 35.3,17.05 33.95,17.05 U$5.5
USART2_TX  (via drill 0.35)
  Top 0.254: U4.8 36.38,17.07 v36.45,17
  Bottom 0.254: v36.45,17 38,17 U$5.6
VIN
  Top 0.61: 9.2,12.43 D3.A
  Top 0.813: JP4.13 23.18,21.18 23.1,21.1 10.6,21.1 7.5,18 U$3.P$4 | 9.15,10.15 9.2,10.1
  Top 1.016: D3.A 9.15,14.85 7.5,16.5 U$3.P$4 | U$1.P$4 18,6.5 16,4.5 10.95,4.5 9.2,6.25 9.2,10.1 9.2,12.43 | 9.15,10.15 4.85,10.15 JP1.3

### Text on the board
tPlace: CANZERO | PWR | OMZLO.COM | LED | NET
bPlace: 5V | VIN | 3.3V | GND | RST | 14 | 13 | 12 | 11 | 10 | 9 | 8 | 7 | 6 | TX | RX | SCL | SCK | MOSI | VIN | CANH | CANL | GND | OMZLO.COM | SDA | MISO | CANL | CANH | GND | VIN | CANZERO | GND | CANL | CANH | VIN | AREF | D/A0 | A1 | A2 | A3 | A4 | A5 | A6 | 0 | 1 | ~2 | ~3 | ~4 | ~5